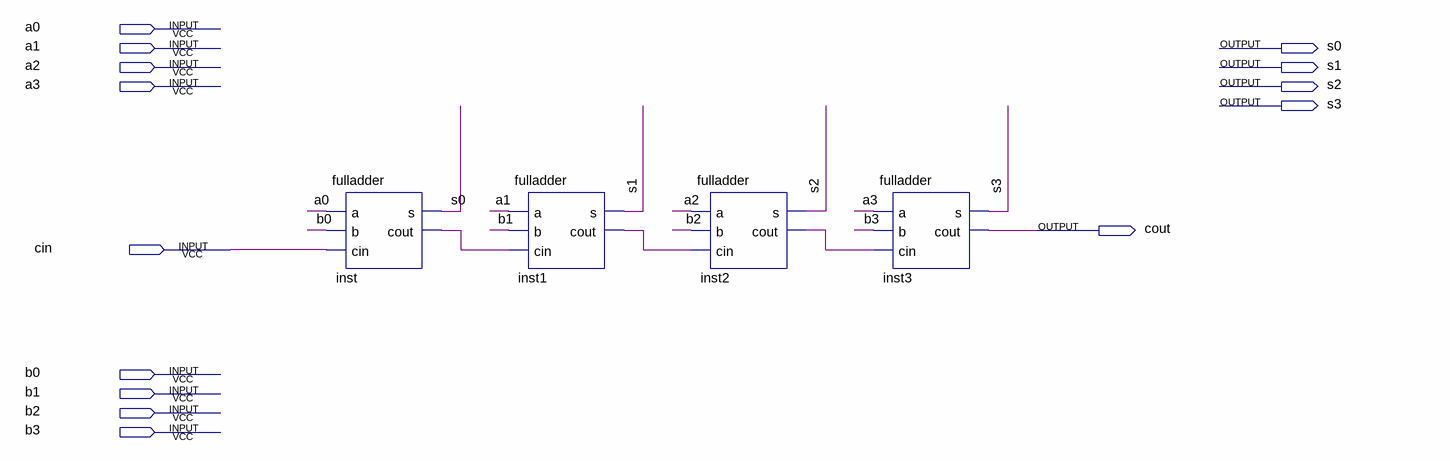
[diagram p0: schematic sheet]
// Quartus schematic somador4bits.bdf as structural Verilog: 4 symbols, 14 pins
module somador4bits (
  input  a0,
  input  a1,
  input  a2,
  input  a3,
  input  cin,
  input  b0,
  input  b1,
  input  b2,
  input  b3,
  output s0,
  output s1,
  output s2,
  output s3,
  output cout
);

  wire inst1_cout, inst2_cout, inst_cout;

  fulladder inst (.a(a0), .b(b0), .cin(cin), .s(s0), .cout(inst_cout));
  fulladder inst1 (.a(a1), .b(b1), .cin(inst_cout), .s(s1), .cout(inst1_cout));
  fulladder inst2 (.a(a2), .b(b2), .cin(inst1_cout), .s(s2), .cout(inst2_cout));
  fulladder inst3 (.a(a3), .b(b3), .cin(inst2_cout), .s(s3), .cout(cout));
endmodule
